# Altium project STM32F302VC_EVM.PrjPcb
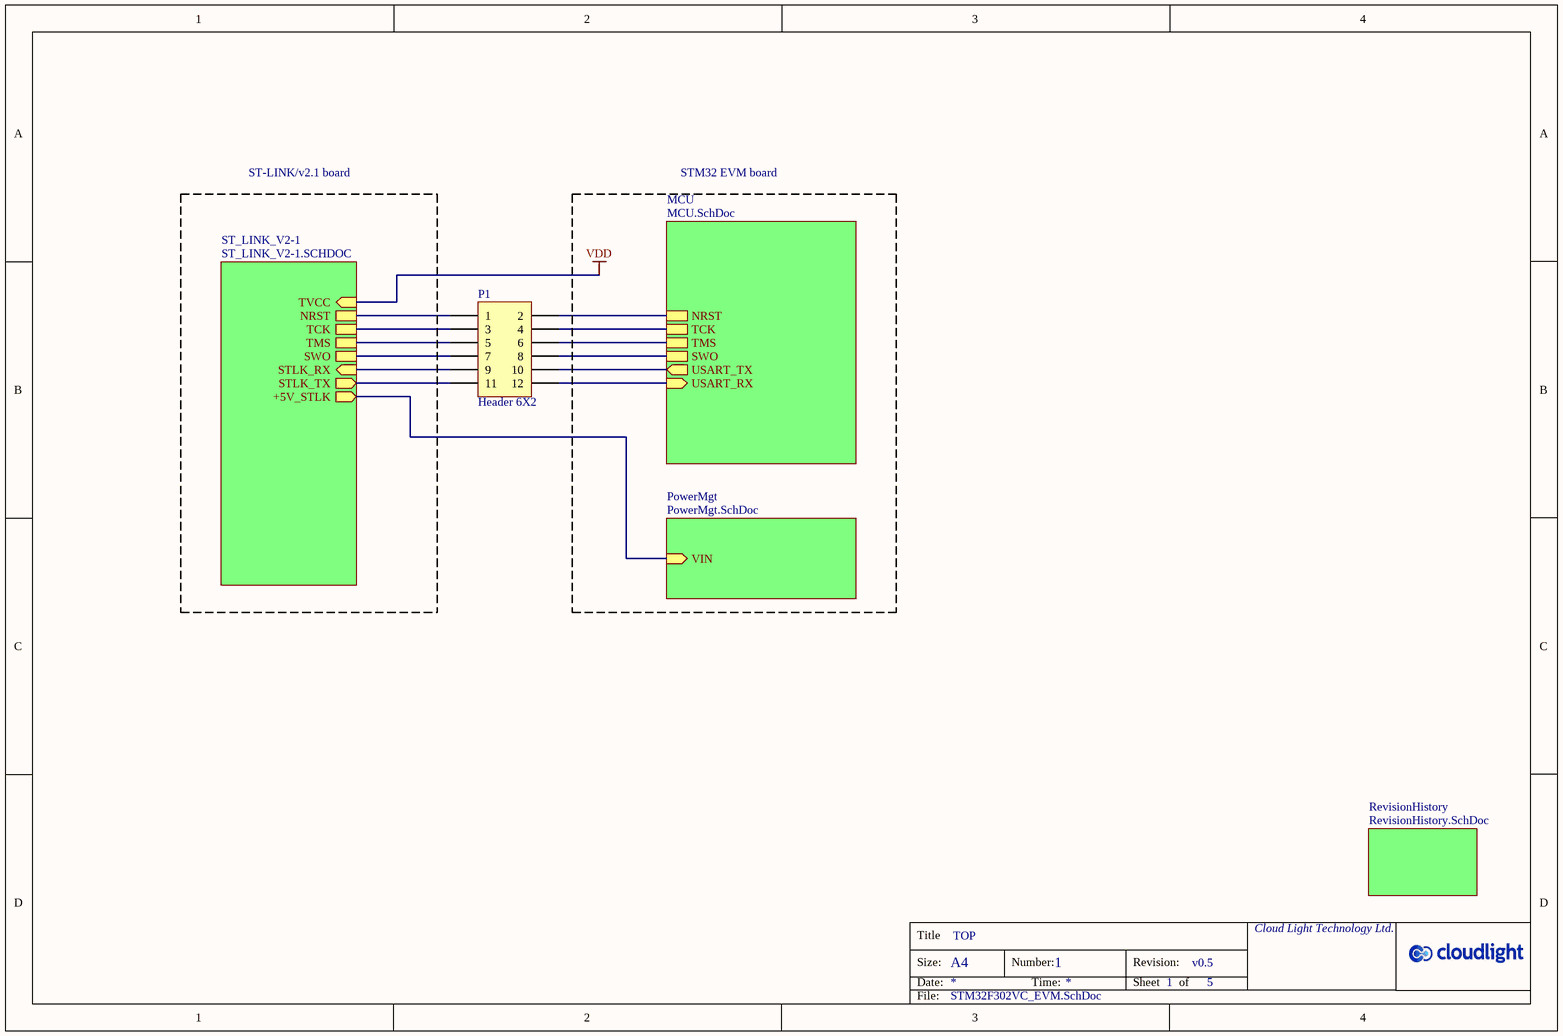
[diagram p0: STM32F302VC_EVM.SchDoc]
5 sheets, 117 parts. Net scope: hierarchical (ports join the sheet entries above them; power ports are global).
Board file: STM32F302VC_EVM.PcbDoc
Sheets:
  STM32F302VC_EVM.SchDoc
    PowerMgt = PowerMgt.SchDoc
    MCU = MCU.SchDoc
    ST_LINK_V2-1 = ST_LINK_V2-1.SchDoc
    RevisionHistory = RevisionHistory.SchDoc

## Sheet STM32F302VC_EVM.SchDoc
size A4; Organization: Altium Limited; Address1: L3, 12a Rodborough Rd; Address2: Frenchs Forest; Address3: NSW; Address4: Australia 2086; DocumentNumber: 1; SheetNumber: 1; SheetTotal: 5

### Parts
P1  Header 6X2  [HDR2X6]

### Sub-sheets
MCU = MCU.SchDoc: NRST, USART_RX (in), USART_TX (out), TCK, TMS, SWO
PowerMgt = PowerMgt.SchDoc: VIN
RevisionHistory = RevisionHistory.SchDoc: no entries
ST_LINK_V2-1 = ST_LINK_V2-1.SCHDOC: TMS, TCK, NRST, STLK_RX (in), STLK_TX (out), SWO, +5V_STLK, TVCC

### Nets
NRST: P1.2 ; sheet MCU/NRST
PA2: P1.10 ; sheet MCU/USART_TX
PA3: P1.12 ; sheet MCU/USART_RX
PA13: P1.6 ; sheet MCU/TMS
PA14: P1.4 ; sheet MCU/TCK
PB3: P1.8 ; sheet MCU/SWO
STLK_RX: P1.9 ; sheet ST_LINK_V2-1/STLK_RX
STLK_TX: P1.11 ; sheet ST_LINK_V2-1/STLK_TX
NetC1_1: sheet PowerMgt/VIN, sheet ST_LINK_V2-1/+5V_STLK
NetP1_1: P1.1 ; sheet ST_LINK_V2-1/NRST
NetP1_3: P1.3 ; sheet ST_LINK_V2-1/TCK
NetP1_5: P1.5 ; sheet ST_LINK_V2-1/TMS
NetP1_7: P1.7 ; sheet ST_LINK_V2-1/SWO

### Notes on the sheet
- ST-LINK/v2.1 board
- STM32 EVM board
- Title
- Size:
- Date:
- A4
- TOP
- Number:
- Time:
- Revision:
- Sheet
- 1
- of
- v0.5
- 5
- Cloud Light Technology Ltd.
- File:
- STM32F302VC_EVM.SchDoc

### Library data of the parts
P1 = Header 6X2: Header, 6-Pin, Dual row; Manufacturer: [N/A]; LatestRevisionDate: 17-Jul-2002; LatestRevisionNote: Re-released for DXP Platform.; Publisher: Altium Limited; PartNumber: [N/A]; Package: HDR2X6/T2.54/B2B; PackageDescription: Connector; Header; 2X6 Position; Pitch 2.54mm; Style Board to Board;; Supplier 1: [N/A]; Supplier Part Number 1: [N/A]

## Sheet PowerMgt.SchDoc
size A4; Organization: Altium Limited; Address1: L3, 12a Rodborough Rd; Address2: Frenchs Forest; Address3: NSW; Address4: Australia 2086; DocumentNumber: 2; SheetNumber: 2; SheetTotal: 5
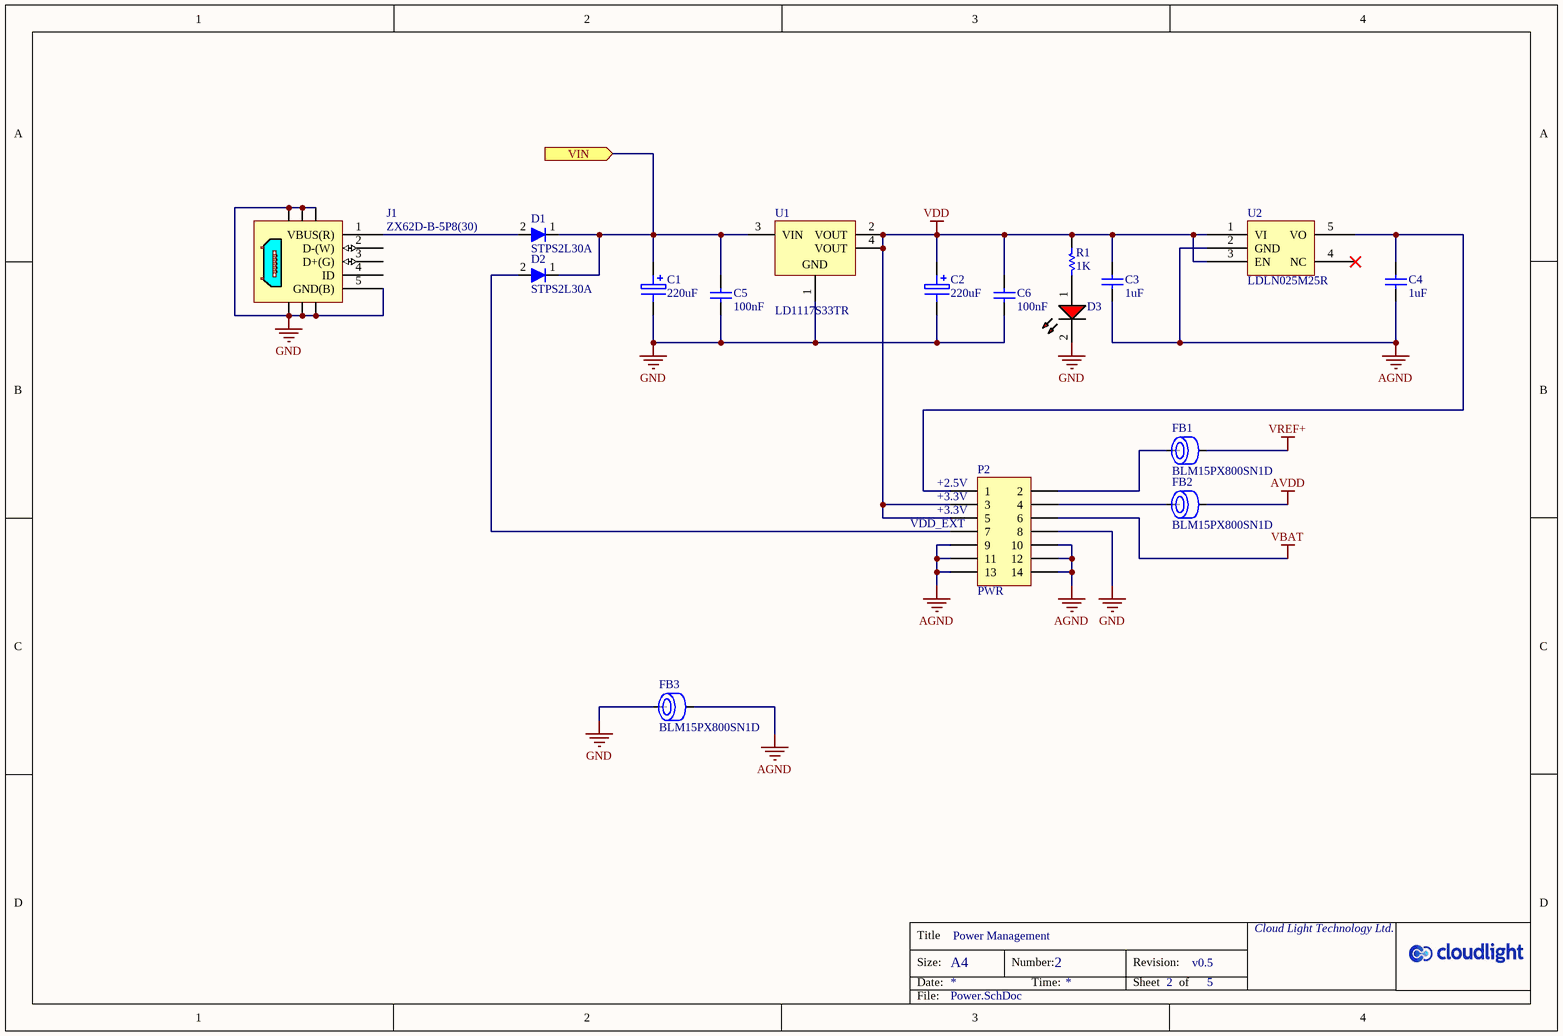
[diagram p1: PowerMgt.SchDoc]

### Parts
C1  220uF  [SMD-EC-F6.3]
C2  220uF  [SMD-EC-F6.3]
C3  1uF  [CAPC1608N]
C4  1uF  [CAPC1608N]
C5  100nF  [CAPC1608N]
C6  100nF  [CAPC1608N]
D1  STPS2L30A  [DIOM4326X25N]
D2  STPS2L30A  [DIOM4326X25N]
D3  LED-SMD0603-R  [CD1608-0603]  (value not drawn)
FB1  BLM15PX800SN1D  [FBC1005N]
FB2  BLM15PX800SN1D  [FBC1005N]
FB3  BLM15PX800SN1D  [FBC1005N]
J1  ZX62D-B-5P8(30)  [USB2.0-4H5]
P2  PWR  [HDR2X7]
R1  1K  [RESC1608N]
U1  LD1117S33TR  [SOT-223_N]
U2  LDLN025M25R  [SOT95P280X145-5N]

### Ports
VIN

### Nets
AGND: C3.1 C4.1 FB3.2 P2.9 P2.10 P2.11 P2.12 P2.13 P2.14 U2.2(GND)
AVDD: FB2.2
GND: C1.2 C2.2 C5.1 C6.1 D3.2(RK) FB3.1 J1.5(GND(B)) J1.6 J1.7 J1.8 J1.9 J1.10 J1.11 P2.8 U1.1(GND)
VBAT: P2.6
VDD: C2.1 C3.2 C6.2 P2.3 P2.5 R1.1 U1.2(VOUT) U1.4(VOUT) U2.1(VI) U2.3(EN)  [project net TVCC]
VREF+: FB1.2
NetC1_1: C1.1 C5.2 D1.1(K) D2.1(K) U1.3(VIN) ; port VIN
NetC4_2: C4.2 P2.1 U2.5(VO)
NetD1_2: D1.2(A) J1.1(VBUS(R))
NetD2_2: D2.2(A) P2.7
NetD3_1: D3.1(RA) R1.2
NetFB1_1: FB1.1 P2.2
NetFB2_1: FB2.1 P2.4

Not connected (* = marked no-connect by the designer): J1 2(D-(W)) 3(D+(G)) 4(ID); U2 4(NC)*

### Notes on the sheet
- (near P2) +2.5V
- (near P2) +3.3V
- (near P2) VDD_EXT
- Title
- Size:
- Date:
- A4
- Power Management
- Number:
- Time:
- Revision:
- Sheet
- 2
- of
- v0.5
- 5
- Cloud Light Technology Ltd.
- File:
- Power.SchDoc

### Library data of the parts
C1 C2 = EEE-FPC221XAP: 220μF 16V Aluminum Electrolytic Capacitors Radial, Can - SMD 160 mohm @ 100kHz 2000 Hrs @ 105°C; Manufacturer: Panasonic Electronic Components; Package: SMD-EC-F6.3; PackageDescription: SMD Aluminum Electrolytic Capacitors, Dia 6.3mm, Height 7.7mm; PartNumber: EEE-FPC221XAP; Supplier 1: Digi-Key; Supplier Part Number 1: PCE4537CT-ND; Value: 220uF
C3 C4 = Chip Capacitor: Manufacturer: [N/A]; Value: 1uF/16V/X7R/±20%; Revision: V1.0.0; Package: 0603; PackageDescription: 0603 Chip Capacitor; PartNumber: [N/A]; Supplier 1: [N/A]; Supplier Part Number 1: [N/A]; Publisher: Wentao SUN; Published: 16-Apr-2019
C5 C6 = Chip Capacitor: Manufacturer: [N/A]; Value: 100nF/16V/X7R/±10%; Revision: V1.0.0; Package: 0603; PackageDescription: 0603 Chip Capacitor; PartNumber: [N/A]; Supplier 1: [N/A]; Supplier Part Number 1: [N/A]; Publisher: Wentao SUN; Published: 16-Apr-2019
D1 D2 = STPS2L30A: Diode Schottky 30V 2A Surface Mount SMA; Manufacturer: STMicroelectronics; PartNumber: STPS2L30A; Package: DO-214AC, SMA; Supplier 1: Digi-Key; Supplier Part Number 1: 497-3759-1-ND; PackageDescription: Molded Diode, 2-Leads, Body 4.27x2.57mm; ComponentLink1Description: Digi-Key; ComponentLink1URL: https://www.digikey.com/products/en?keywords=497-3759-2-ND; Publisher: Wentao SUN; Published: 18-Apr-2019
D3 = LED-SMD0603-R: Single Color LED Indication, 0603, Red; Manufacturer: [N/A]; ComponentLink1Description: [N/A]; ComponentLink1URL: [N/A]; Package: 0603; PackageDescription: Chip Diode; Body 1.6 x 0.8 mm (LxW typ); PartNumber: [N/A]; Published: 21-Apr-2019; Publisher: Wentao SUN; Supplier 1: [N/A]; Supplier Part Number 1: [N/A]
FB1-FB3 = Ferrite Bead: 80 Ohms @ 100MHz 1 Power Line Ferrite Bead 0402 (1005 Metric) 2.3A 38mOhm; Manufacturer: Murata Electronics North America; Published: 16-Apr-2019; Revision: V1.0.0; Publisher: Wentao SUN; Package: 0402; PackageDescription: Chip Ferrite Bead Body 1.1x0.5mm; PartNumber: BLM15PX800SN1D; Supplier 1: Digi-Key; Supplier Part Number 1: 490-10663-1-ND
J1 = ZX62D-B-5P8(30): USB - micro B USB 2.0 Receptacle Connector 5-Pin; Manufacturer: Hirose Electric Co Ltd; PartNumber: ZX62D-B-5P8(30); Package: USB2.0-4H5; PackageDescription: USB Micro B, 0.65mm Pitch, 4 holes; Supplier 1: Digi-Key; Supplier Part Number 1: H125272CT-ND; ComponentLink1URL: https://www.digikey.com/products/en?keywords=H125272TR-ND; ComponentLink1Description: Digi-Key
P2 = Header 7X2: Header, 7-Pin, Dual row; Manufacturer: [N/A]; LatestRevisionDate: 17-Jul-2002; LatestRevisionNote: Re-released for DXP Platform.; Publisher: Altium Limited; PartNumber: [N/A]; Package: HDR2X7/T2.54/B2B; PackageDescription: Connector; Header; 2X7 Position; Pitch 2.54mm; Style Board to Board;; Supplier 1: [N/A]; Supplier Part Number 1: [N/A]
R1 = Chip Resistor: Manufacturer: [N/A]; Value: 1K/±5%/0.1W; Published: 16-Apr-2019; Revision: V1.0.0; Publisher: Wentao SUN; Package: 0603; PackageDescription: 0603 Chip Resistor; PartNumber: [N/A]; Supplier 1: [N/A]; Supplier Part Number 1: [N/A]
U1 = LD1117S33TR: Fixed Low Drop Positive Voltage Regulator, 3.3V, 4-Pin SOT-223, Tape and Reel; Manufacturer: STMicroelectronics; DatasheetVersion: Nov-2011; PackageVersion: 2010; PackageReference: SOT-223; PackageDescription: 4-Pin SOT-223 Package, 6.5 x 3.5 mm Body, 2.3 mm Pitch, 7 mm Lead Span; PartNumber: LD1117S33TR; ComponentLink1Description: Manufacturer URL; ComponentLink1URL: http://www.st.com; ComponentLink2Description: Datasheet; ComponentLink2URL: http://www.st.com/internet/com/TECHNICAL_RESOURCES/TECHNICAL_LITERATURE/DATASHEET/CD00000544.pdf; Package: SOT-223; Supplier 1: Digi-Key; Supplier Part Number 1: 497-1242-1-ND
U2 = LDLN025M25R: Linear Voltage Regulator IC  1 Output  250mA SOT-23-5; Manufacturer: STMicroelectronics; PartNumber: LDLN025M25R; PackageDescription: Small Outine Transistor 5 Leads; Supplier 1: Digi-Key; Supplier Part Number 1: 497-17805-1-ND; Package: SOT-23-5L

## Sheet MCU.SchDoc
size A4; Organization: Altium Limited; Address1: L3, 12a Rodborough Rd; Address2: Frenchs Forest; Address3: NSW; Address4: Australia 2086; DocumentNumber: 4; SheetNumber: 4; SheetTotal: 5
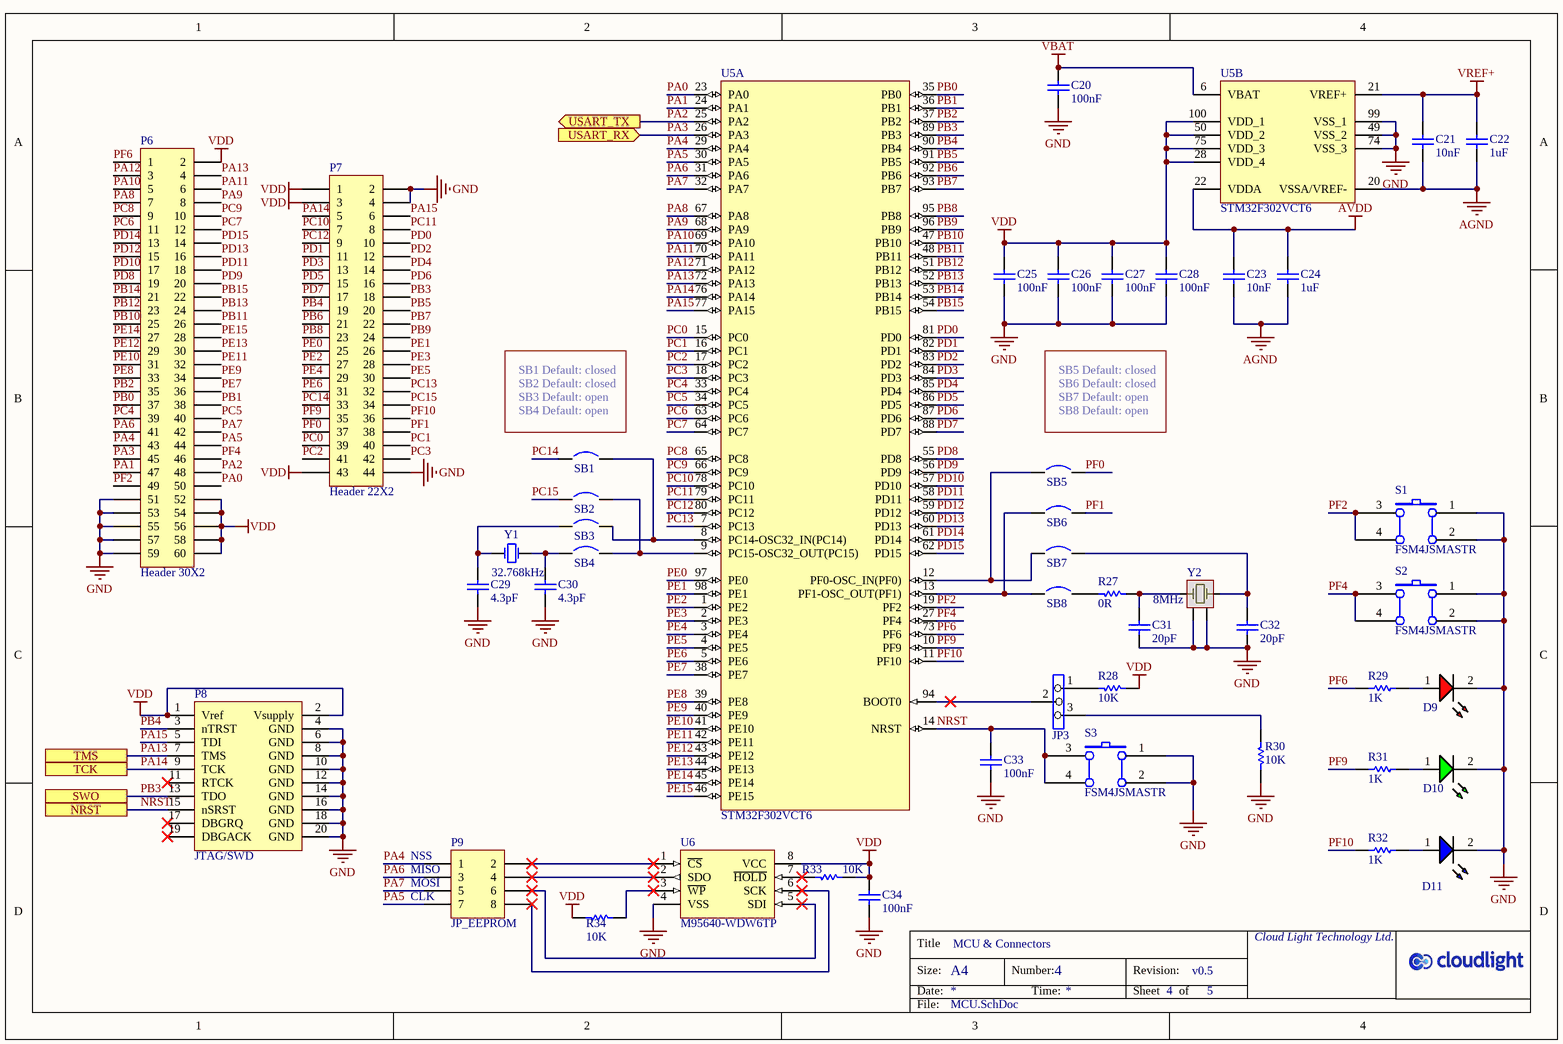
[diagram p2: MCU.SchDoc]

### Parts
C20  100nF  [CAPC1608N]
C21  10nF  [CAPC1608N]
C22  1uF  [CAPC1608N]
C23  10nF  [CAPC1608N]
C24  1uF  [CAPC1608N]
C25  100nF  [CAPC1608N]
C26  100nF  [CAPC1608N]
C27  100nF  [CAPC1608N]
C28  100nF  [CAPC1608N]
C29  4.3pF  [CAPC1608N]
C30  4.3pF  [CAPC1608N]
C31  20pF  [CAPC1608N]
C32  20pF  [CAPC1608N]
C33  100nF  [CAPC1608N]
C34  100nF  [CAPC1608N]
D9  LED-SMD0603-R  [CD1608-0603]  (value not drawn)
D10  LED-SMD0603-G  [CD1608-0603]  (value not drawn)
D11  LED-SMD0603-B  [CD1608-0603]  (value not drawn)
JP3  JP3  [SIP3/2.54]  (value not drawn)
P6  Header 30X2  [HDR2X30]
P7  Header 22X2  [HDR2X22]
P8  JTAG/SWD  [HDR2X10/T2.54/B2C]
P9  JP_EEPROM  [HDR2X4]
R27  0R  [RESC1608N]
R28  10K  [RESC1608N]
R29  1K  [RESC1608N]
R30  10K  [RESC1608N]
R31  1K  [RESC1608N]
R32  1K  [RESC1608N]
R33  10K  [RESC1608N]
R34  10K  [RESC1608N]
S1  FSM4JSMASTR  [SW_4PIN_S_6.0X6.0MM]
S2  FSM4JSMASTR  [SW_4PIN_S_6.0X6.0MM]
S3  FSM4JSMASTR  [SW_4PIN_S_6.0X6.0MM]
SB1  Circuit Breaker  [JP2_SMD]  (value not drawn)  (no BOM)
SB2  Circuit Breaker  [JP2_SMD]  (value not drawn)  (no BOM)
SB3  Circuit Breaker  [JP2_SMD]  (value not drawn)  (no BOM)
SB4  Circuit Breaker  [JP2_SMD]  (value not drawn)  (no BOM)
SB5  Circuit Breaker  [JP2_SMD]  (value not drawn)  (no BOM)
SB6  Circuit Breaker  [JP2_SMD]  (value not drawn)  (no BOM)
SB7  Circuit Breaker  [JP2_SMD]  (value not drawn)  (no BOM)
SB8  Circuit Breaker  [JP2_SMD]  (value not drawn)  (no BOM)
U5  STM32F302VCT6  [STM-LQFP100_N]  (parts A,B of 2)
U6  M95640-WDW6TP  [TSOP65P640X120-8N]
Y1  32.768kHz  [FC-12M]
Y2  8MHz  [12SMX-B-N]

### Ports
NRST, SWO, TCK, TMS, USART_RX (in), USART_TX (out)

### Nets
AGND: C21.1 C22.1 C23.1 C24.1 U5.20(VSSA/VREF-)
AVDD: C23.2 C24.2 U5.22(VDDA)
GND: C20.1 C25.1 C26.1 C27.1 C28.1 C29.1 C30.1 C31.1 C32.1 C33.1 C34.1 D9.2(RK) D10.2(RK) D11.2(RK) P6.51 P6.53 P6.55 P6.57 P6.59 P7.2 P7.4 P7.44 P8.4(GND) P8.6(GND) P8.8(GND) P8.10(GND) P8.12(GND) P8.14(GND) P8.16(GND) P8.18(GND) P8.20(GND) R30.2 S1.1 S1.2 S2.1 S2.2 S3.1 S3.2 U5.49(VSS_2) U5.74(VSS_3) U5.99(VSS_1) U6.4(VSS) Y2.2(GND) Y2.4(GND)
VBAT: C20.2 U5.6(VBAT)
VDD: C25.2 C26.2 C27.2 C28.2 C34.2 P6.2 P6.52 P6.54 P6.56 P6.58 P6.60 P7.1 P7.3 P7.43 P8.1(Vref) P8.2(Vsupply) R28.2 R33.2 R34.1 U5.28(VDD_4) U5.50(VDD_2) U5.75(VDD_3) U5.100(VDD_1) U6.8(VCC)  [project net TVCC]
VREF+: C21.2 C22.2 U5.21(VREF+)
NRST: C33.2 P8.15(nSRST) S3.3 S3.4 U5.14(NRST) ; port NRST
PA0: P6.50 U5.23(PA0)
PA1: P6.47 U5.24(PA1)
PA2: P6.48 U5.25(PA2) ; port USART_TX
PA3: P6.45 U5.26(PA3) ; port USART_RX
PA4: P6.43 P9.1 U5.29(PA4)
PA5: P6.44 P9.7 U5.30(PA5)
PA6: P6.41 P9.3 U5.31(PA6)
PA7: P6.42 P9.5 U5.32(PA7)
PA8: P6.7 U5.67(PA8)
PA9: P6.8 U5.68(PA9)
PA10: P6.5 U5.69(PA10)
PA11: P6.6 U5.70(PA11)
PA12: P6.3 U5.71(PA12)
PA13: P6.4 P8.7(TMS) U5.72(PA13) ; port TMS
PA14: P7.5 P8.9(TCK) U5.76(PA14) ; port TCK
PA15: P7.6 P8.5(TDI) U5.77(PA15)
PB0: P6.37 U5.35(PB0)
PB1: P6.38 U5.36(PB1)
PB2: P6.35 U5.37(PB2)
PB3: P7.18 P8.13(TDO) U5.89(PB3) ; port SWO
PB4: P7.19 P8.3(nTRST) U5.90(PB4)
PB5: P7.20 U5.91(PB5)
PB6: P7.21 U5.92(PB6)
PB7: P7.22 U5.93(PB7)
PB8: P7.23 U5.95(PB8)
PB9: P7.24 U5.96(PB9)
PB10: P6.25 U5.47(PB10)
PB11: P6.26 U5.48(PB11)
PB12: P6.23 U5.51(PB12)
PB13: P6.24 U5.52(PB13)
PB14: P6.21 U5.53(PB14)
PB15: P6.22 U5.54(PB15)
PC0: P7.39 U5.15(PC0)
PC1: P7.40 U5.16(PC1)
PC2: P7.41 U5.17(PC2)
PC3: P7.42 U5.18(PC3)
PC4: P6.39 U5.33(PC4)
PC5: P6.40 U5.34(PC5)
PC6: P6.11 U5.63(PC6)
PC7: P6.12 U5.64(PC7)
PC8: P6.9 U5.65(PC8)
PC9: P6.10 U5.66(PC9)
PC10: P7.7 U5.78(PC10)
PC11: P7.8 U5.79(PC11)
PC12: P7.9 U5.80(PC12)
PC13: P7.32 U5.7(PC13)
PC14: P7.33 SB1.1
PC15: P7.34 SB2.1
PD0: P7.10 U5.81(PD0)
PD1: P7.11 U5.82(PD1)
PD2: P7.12 U5.83(PD2)
PD3: P7.13 U5.84(PD3)
PD4: P7.14 U5.85(PD4)
PD5: P7.15 U5.86(PD5)
PD6: P7.16 U5.87(PD6)
PD7: P7.17 U5.88(PD7)
PD8: P6.19 U5.55(PD8)
PD9: P6.20 U5.56(PD9)
PD10: P6.17 U5.57(PD10)
PD11: P6.18 U5.58(PD11)
PD12: P6.15 U5.59(PD12)
PD13: P6.16 U5.60(PD13)
PD14: P6.13 U5.61(PD14)
PD15: P6.14 U5.62(PD15)
PE0: P7.25 U5.97(PE0)
PE1: P7.26 U5.98(PE1)
PE2: P7.27 U5.1(PE2)
PE3: P7.28 U5.2(PE3)
PE4: P7.29 U5.3(PE4)
PE5: P7.30 U5.4(PE5)
PE6: P7.31 U5.5(PE6)
PE7: P6.36 U5.38(PE7)
PE8: P6.33 U5.39(PE8)
PE9: P6.34 U5.40(PE9)
PE10: P6.31 U5.41(PE10)
PE11: P6.32 U5.42(PE11)
PE12: P6.29 U5.43(PE12)
PE13: P6.30 U5.44(PE13)
PE14: P6.27 U5.45(PE14)
PE15: P6.28 U5.46(PE15)
PF0: P7.37 SB5.2
PF1: P7.38 SB6.2
PF2: P6.49 S1.3 S1.4 U5.19(PF2)
PF4: P6.46 S2.3 S2.4 U5.27(PF4)
PF6: P6.1 R29.1 U5.73(PF6)
PF9: P7.35 R31.1 U5.10(PF9)
PF10: P7.36 R32.1 U5.11(PF10)
NetC29_2: C29.2 SB3.1 Y1.2(OSC2)
NetC30_2: C30.2 SB4.1 Y1.1(OSC1)
NetC31_2: C31.2 R27.1 Y2.1(OSC1)
NetC32_2: C32.2 SB7.2 Y2.3(OSC2)
NetD9_1: D9.1(RA) R29.2
NetD10_1: D10.1(RA) R31.2
NetD11_1: D11.1(RA) R32.2
NetJP3_1: JP3.1 R28.1
NetJP3_2: JP3.2 U5.94(BOOT0)
NetJP3_3: JP3.3 R30.1
NetP9_2: P9.2 U6.1(~{CS})
NetP9_4: P9.4 U6.2(SDO)
NetP9_6: P9.6 U6.5(SDI)
NetP9_8: P9.8 U6.6(SCK)
NetR27_2: R27.2 SB8.2
NetR33_1: R33.1 U6.7(~{HOLD})
NetR34_2: R34.2 U6.3(~{WP})
NetSB1_2: SB1.2 SB3.2 U5.8(PC14-OSC32_IN(PC14))
NetSB2_2: SB2.2 SB4.2 U5.9(PC15-OSC32_OUT(PC15))
NetSB5_1: SB5.1 SB7.1 U5.12(PF0-OSC_IN(PF0))
NetSB6_1: SB6.1 SB8.1 U5.13(PF1-OSC_OUT(PF1))

Not connected (* = marked no-connect by the designer): P8 11(RTCK)* 17(DBGRQ)* 19(DBGACK)*

### Notes on the sheet
- SB1 Default: closed
- SB2 Default: closed
- SB5 Default: closed
- SB6 Default: closed
- SB3 Default: open
- (near SB1) SB4 Default: open
- SB7 Default: open
- SB8 Default: open
- (near P9) NSS
- (near P9) MISO
- (near P9) MOSI
- (near P9) CLK
- Title
- Size:
- Date:
- A4
- MCU & Connectors
- Number:
- Time:
- Revision:
- Sheet
- 4
- of
- v0.5
- 5
- Cloud Light Technology Ltd.
- File:
- MCU.SchDoc

### Library data of the parts
C20 C25-C28 C33 C34 = Chip Capacitor: as C5 on sheet PowerMgt; Revision: V1.0.0; Package: 0603; PackageDescription: 0603 Chip Capacitor; PartNumber: [N/A]; Supplier 1: [N/A]; Supplier Part Number 1: [N/A]; Publisher: Wentao SUN; Published: 16-Apr-2019
C21 C23 = Chip Capacitor: Manufacturer: [N/A]; Value: 10nF/25V/X7R/±20%; Revision: V1.0.0; Package: 0603; PackageDescription: 0603 Chip Capacitor; PartNumber: [N/A]; Supplier 1: [N/A]; Supplier Part Number 1: [N/A]; Publisher: Wentao SUN; Published: 16-Apr-2019
C22 C24 = Chip Capacitor: as C3 on sheet PowerMgt; Revision: V1.0.0; Package: 0603; PackageDescription: 0603 Chip Capacitor; PartNumber: [N/A]; Supplier 1: [N/A]; Supplier Part Number 1: [N/A]; Publisher: Wentao SUN; Published: 16-Apr-2019
C29 C30 = Chip Capacitor: Manufacturer: [N/A]; Value: 4.3pF/100V/C0G/±0.25pF; Revision: V1.0.0; Package: 0603; PackageDescription: 0603 Chip Capacitor; PartNumber: [N/A]; Supplier 1: [N/A]; Supplier Part Number 1: [N/A]; Publisher: Wentao SUN; Published: 16-Apr-2019
C31 C32 = Chip Capacitor: Manufacturer: [N/A]; Value: 20pF/100V/C0G/±5%; Revision: V1.0.0; Package: 0603; PackageDescription: 0603 Chip Capacitor; PartNumber: [N/A]; Supplier 1: [N/A]; Supplier Part Number 1: [N/A]; Publisher: Wentao SUN; Published: 16-Apr-2019
D9 = LED-SMD0603-R: as D3 on sheet PowerMgt; ComponentLink1Description: [N/A]; ComponentLink1URL: [N/A]; Package: 0603; PackageDescription: Chip Diode; Body 1.6 x 0.8 mm (LxW typ); PartNumber: [N/A]; Published: 21-Apr-2019; Publisher: Wentao SUN; Supplier 1: [N/A]; Supplier Part Number 1: [N/A]
D10 = LED-SMD0603-G: Single Color LED Indication, 0603, Green; Manufacturer: [N/A]; ComponentLink1Description: [N/A]; ComponentLink1URL: [N/A]; Package: 0603; PackageDescription: Chip Diode; Body 1.6 x 0.8 mm (LxW typ); PartNumber: [N/A]; Published: 21-Apr-2019; Publisher: Wentao SUN; Supplier 1: [N/A]; Supplier Part Number 1: [N/A]
D11 = LED-SMD0603-B: Single Color LED Indication, 0603, Blue; Manufacturer: [N/A]; ComponentLink1Description: [N/A]; ComponentLink1URL: [N/A]; Package: 0603; PackageDescription: Chip Diode; Body 1.6 x 0.8 mm (LxW typ); PartNumber: [N/A]; Published: 21-Apr-2019; Publisher: Wentao SUN; Supplier 1: [N/A]; Supplier Part Number 1: [N/A]
JP3 = JP3: Jumper 3; Manufacturer: [N/A]; PartNumber: [N/A]; Package: HDR3/T2.54/B2B; PackageDescription: Connector; Header; 3 Position; Pitch 2.54mm; Style Board to Board;; Supplier 1: [N/A]; Supplier Part Number 1: [N/A]
P6 = Header 30X2: Header, 30-Pin, Dual row; Manufacturer: [N/A]; LatestRevisionDate: 17-Jul-2002; LatestRevisionNote: Re-released for DXP Platform.; Publisher: Altium Limited; PartNumber: [N/A]; Supplier Part Number 1: [N/A]; Supplier 1: [N/A]; Package: HDR2X30/T2.54/B2B; PackageDescription: Connector; Header; 2X30 Position; Pitch 2.54mm; Style Board to Board;
P7 = Header 22X2: Header, 22-Pin, Dual row; Manufacturer: [N/A]; LatestRevisionDate: 17-Jul-2002; LatestRevisionNote: Re-released for DXP Platform.; Publisher: Altium Limited; PartNumber: [N/A]; Supplier Part Number 1: [N/A]; Supplier 1: [N/A]; Package: HDR2X22/T2.54/B2B; PackageDescription: Connector; Header; 2X22 Position; Pitch 2.54mm; Style Board to Board;
P8 = JTAG: Header, JTAG; Manufacturer: On Shore Technology Inc.; PartNumber: 302-S201; LatestRevisionDate: 17-Apr-2019; LatestRevisionNote: Re-released for DXP Platform.; Publisher: Wentao SUN; Package: HDR2X10/T2.54/B2C; PackageDescription: Connector; Header; 10x2 Position; Pitch 2.54mm; Style Board to Cable;; Supplier 1: Digi-Key; Supplier Part Number 1: ED10524-ND; ComponentLink1Description: Digi-Key; ComponentLink1URL: https://www.digikey.com/products/en?keywords=ED10524-ND
P9 = Header 4X2: Header, 4-Pin, Dual row; Manufacturer: [N/A]; LatestRevisionDate: 17-Jul-2002; LatestRevisionNote: Re-released for DXP Platform.; Publisher: Altium Limited; Package: HDR2X4/T2.54/B2B; PackageDescription: Connector; Header; 2X4 Position; Pitch 2.54mm; Style Board to Board;; Supplier 1: [N/A]; Supplier Part Number 1: [N/A]; PartNumber: [N/A]; ComponentLink1Description: [N/A]; ComponentLink1URL: [N/A]
R27 = Chip Resistor: Manufacturer: [N/A]; Value: 0R/Jumper/0.1W; Published: 16-Apr-2019; Revision: V1.0.0; Publisher: Wentao SUN; Package: 0603; PackageDescription: 0603 Chip Resistor; PartNumber: [N/A]; Supplier 1: [N/A]; Supplier Part Number 1: [N/A]
R28 R30 R33 R34 = Chip Resistor: Manufacturer: [N/A]; Value: 10K/±5%/0.1W; Published: 16-Apr-2019; Revision: V1.0.0; Publisher: Wentao SUN; Package: 0603; PackageDescription: 0603 Chip Resistor; PartNumber: [N/A]; Supplier 1: [N/A]; Supplier Part Number 1: [N/A]
R29 R31 R32 = Chip Resistor: Manufacturer: [N/A]; Value: 1K/±5%/0.1W; Published: 16-Apr-2019; Revision: V1.0.0; Publisher: Wentao SUN; Package: 0603; PackageDescription: 0603 Chip Resistor; PartNumber: [N/A]; Supplier 1: [N/A]; Supplier Part Number 1: [N/A]
S1-S3 = FSM4JSMASTR: Tactile Switch SPST-NO Top Actuated Surface Mount; Manufacturer: TE Connectivity; Package: SW_4PIN_S_6.0X6.0MM; PackageDescription: Surface Mount Switch, 4 Leads, Body 6.0*6.0mm, Pitch 4.5mm/8.4mm; PartNumber: FSM4JSMASTR; Supplier 1: Digi-Key; Supplier Part Number 1: 450-2141-1-ND
SB1-SB8 = Circuit Breaker: Solder: NO; Published: 24-Mar-1999; Revision: July-2002: Re-released for DXP Platform.; Publisher: Altium Limited
U5 = STM32F302VCT6: ARM Cortex-M4 32-bit MCU, 256 KB Flash, 32 KB Internal RAM, 87 I/Os, 100-pin LQFP, -40 to 85 degC, Tray; Manufacturer: STMicroelectronics; D/A Converter: 1x12-bit (1 Channel); FLASH Size (Prog) (kB): 256; I/Os (High Current): 87; Internal RAM Size (kB): 32; Operating Frequency(F) (Processor speed) (MHz): 72; Supply Voltage(Vcc) min (V): 2; DatasheetVersion: Rev. 6; PackageVersion: Rev. 1, 06/2013; PackageReference: LQFP100; PackageDescription: 100-Pin Low Profile Quad Flat Package, 14 x 14 mm Body, 0.5 mm Pitch; Supplier 1: Digi-Key; Supplier Part Number 1: 497-17420-ND; Supplier 2: Farnell; Supplier Part Number 2: 2333253; Supplier 3: Newark; Supplier Part Number 3: 99W9870; Supplier 4: Newark; Supplier Part Number 4: 48W6878; Supplier 5: Mouser; Supplier Part Number 5: 511-STM32F302VCT6; Core: ARM Cortex-M4; Packing: Tray; Mounting Technology: Surface Mount; PartNumber: STM32F302VCT6; ComponentLink1Description: Manufacturer URL; ComponentLink1URL: http://www.st.com/web/en/home.html; ComponentLink2Description: Datasheet; ComponentLink2URL: http://www.st.com/st-web-ui/static/active/en/resource/technical/document/datasheet/DM00058181.pdf; ComponentLink3Description: Package Specification; ComponentLink3URL: http://www.st.com/st-web-ui/static/active/en/resource/technical/document/data_brief/DM00071938.pdf; Package: LQFP100
U6 = M95640-WDW6TP: EEPROM Memory IC 64Kb (8K x 8) SPI 20MHz 8-TSSOP; Manufacturer: STMicroelectronics; Package: 8-TSSOP; PackageDescription: TSOP, 8-Leads, Body 3.00x4.40mm, Pitch 0.65mm; PartNumber: M95640-WDW6TP; Supplier 1: Digi-Key; Supplier Part Number 1: 497-8699-1-ND
Y1 = FC-12M 32.7680KA-A5: 32.768kHz ±20ppm Crystal 12.5pF 90 kOhms 2-SMD, No Lead; Manufacturer: EPSON; Package: FC-12M; PackageDescription: 2-SMD, No Lead, Outline 2.05*1.20mm; PartNumber: FC-12M 32.7680KA-A5; Supplier 1: Digi-Key; Supplier Part Number 1: SER4080CT-ND; Value: 32.768kHz
Y2 = LFXTAL056516REEL: 8MHz ±30ppm Crystal 12pF 80 Ohms 4-SMD, No Lead; Manufacturer: IQD Frequency Product Ltd.; Package: 12SMX-B; PackageDescription: 4-SMD, No Lead; PartNumber: LFXTAL056516REEL; Supplier 1: Digi-Key; Supplier Part Number 1: 1923-1017-1-ND; Value: 8MHz

## Sheet ST_LINK_V2-1.SchDoc
size A4; Organization: Altium Limited; Address1: L3, 12a Rodborough Rd; Address2: Frenchs Forest; Address3: NSW; Address4: Australia 2086; DocumentNumber: 3; SheetNumber: 3; SheetTotal: 5
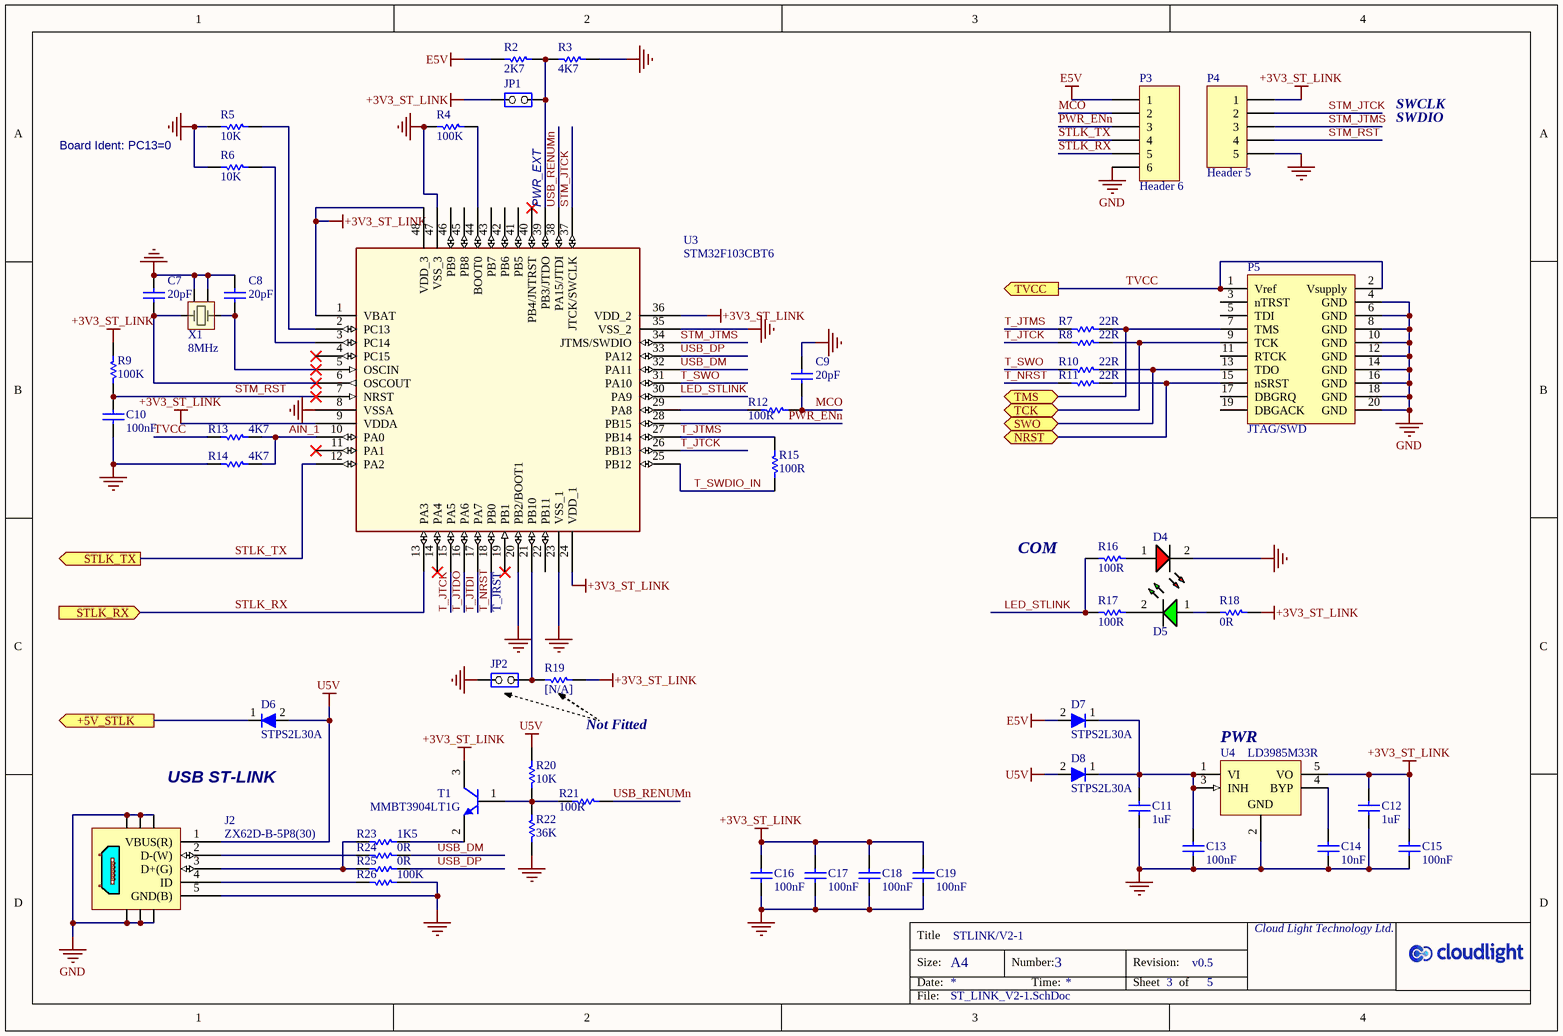
[diagram p3: ST_LINK_V2-1.SchDoc]

### Parts
C7  20pF  [CAPC1608N]
C8  20pF  [CAPC1608N]
C9  20pF  [CAPC1608N]
C10  100nF  [CAPC1608N]
C11  1uF  [CAPC1608N]
C12  1uF  [CAPC1608N]
C13  100nF  [CAPC1608N]
C14  10nF  [CAPC1608N]
C15  100nF  [CAPC1608N]
C16  100nF  [CAPC1608N]
C17  100nF  [CAPC1608N]
C18  100nF  [CAPC1608N]
C19  100nF  [CAPC1608N]
D4  LED-SMD0603-R  [CD1608-0603]  (value not drawn)
D5  LED-SMD0603-G  [CD1608-0603]  (value not drawn)
D6  STPS2L30A  [DIOM4326X25N]
D7  STPS2L30A  [DIOM4326X25N]
D8  STPS2L30A  [DIOM4326X25N]
J2  ZX62D-B-5P8(30)  [USB2.0-4H5]
JP1  JP2  [SIP2/2.54]  (value not drawn)
JP2  JP2  [SIP2/2.54]  (value not drawn)
P3  Header 6  [HDR1X6]
P4  Header 5  [HDR1X5]
P5  JTAG/SWD  [HDR2X10/T2.54/B2C]
R2  2K7  [RESC1608N]
R3  4K7  [RESC1608N]
R4  100K  [RESC1608N]
R5  10K  [RESC1608N]
R6  10K  [RESC1608N]
R7  22R  [RESC1608N]
R8  22R  [RESC1608N]
R9  100K  [RESC1608N]
R10  22R  [RESC1608N]
R11  22R  [RESC1608N]
R12  100R  [RESC1608N]
R13  4K7  [RESC1608N]
R14  4K7  [RESC1608N]
R15  100R  [RESC1608N]
R16  100R  [RESC1608N]
R17  100R  [RESC1608N]
R18  0R  [RESC1608N]
R19  [N/A]  [RESC1608N]
R20  10K  [RESC1608N]
R21  100R  [RESC1608N]
R22  36K  [RESC1608N]
R23  1K5  [RESC1608N]
R24  0R  [RESC1608N]
R25  0R  [RESC1608N]
R26  100K  [RESC1608N]
T1  MMBT3904LT1G  [ONSC-SOT-23-3-318-08_V]
U3  STM32F103CBT6  [QFP48 7X7]
U4  LD3985M33R  [SOT23-5L_N]
X1  8MHz  [12SMX-B-N]

### Ports
+5V_STLK, NRST, STLK_RX (in), STLK_TX (out), SWO, TCK, TMS, TVCC

### Nets
+3V3_ST_LINK: C12.2 C15.2 C16.2 C17.2 C18.2 C19.2 JP1.1(COMMON) P4.1 R9.2 R18.1 R19.1 T1.3(C) U3.1(VBAT) U3.9(VDDA) U3.24(VDD_1) U3.36(VDD_2) U3.48(VDD_3) U4.5(VO)
E5V: D7.2(A) P3.1 R2.1
GND: C7.2 C8.2 C9.2 C10.1 C11.1 C12.1 C13.1 C14.1 C15.1 C16.1 C17.1 C18.1 C19.1 D4.2(RK) J2.5(GND(B)) J2.6 J2.7 J2.8 J2.9 J2.10 J2.11 JP2.1(COMMON) P3.6 P4.5 P5.4(GND) P5.6(GND) P5.8(GND) P5.10(GND) P5.12(GND) P5.14(GND) P5.16(GND) P5.18(GND) P5.20(GND) R3.2 R4.1 R5.1 R6.1 R14.1 R22.1 R26.2 U3.8(VSSA) U3.20(PB2/BOOT1) U3.23(VSS_1) U3.35(VSS_2) U3.47(VSS_3) U4.2(GND) X1.2(GND) X1.4(GND)
TVCC: P5.1(Vref) P5.2(Vsupply) R13.1 ; port TVCC
U5V: D6.2(A) D8.2(A) J2.1(VBUS(R)) R20.2
AIN_1: R13.2 R14.2 U3.10(PA0)
LED_STLINK: R16.2 R17.2 U3.30(PA9)
MCO: C9.1 P3.2 R12.2
PWR_ENn: P3.3 U3.28(PB15)
STLK_RX: P3.5 U3.13(PA3) ; port STLK_RX
STLK_TX: P3.4 U3.12(PA2) ; port STLK_TX
STM_JTCK: P4.2 U3.37(JTCK/SWCLK)
STM_JTMS: P4.3 U3.34(JTMS/SWDIO)
STM_RST: C10.2 P4.4 R9.1 U3.7(NRST)
T_JTCK: R8.1 U3.15(PA5) U3.26(PB13)
T_JTDI: U3.17(PA7)
T_JTDO: U3.16(PA6)
T_JTMS: R7.1 R15.2 U3.27(PB14)
T_NRST: R11.1 U3.18(PB0)
T_SWDIO_IN: R15.1 U3.25(PB12)
T_SWO: R10.1 U3.31(PA10)
USB_DM: R24.2 U3.32(PA11)
USB_DP: R25.2 U3.33(PA12)
USB_RENUMn: R21.2 U3.38(PA15/JTDI)
NetC1_1: D6.1(K) ; port +5V_STLK
NetC7_1: C7.1 U3.6(OSCOUT) X1.3(OSC2)
NetC8_1: C8.1 U3.5(OSCIN) X1.1(OSC1)
NetC11_2: C11.2 C13.2 D7.1(K) D8.1(K) U4.1(VI) U4.3(INH)
NetC14_2: C14.2 U4.4(BYP)
NetD4_1: D4.1(RA) R16.1
NetD5_1: D5.1(RA) R18.2
NetD5_2: D5.2(RK) R17.1
NetJ2_2: J2.2(D-(W)) R24.1
NetJ2_3: J2.3(D+(G)) R23.1 R25.1
NetJ2_4: J2.4(ID) R26.1
NetJP1_2: JP1.2(NO) R2.2 R3.1 U3.39(PB3/JTDO)
NetJP2_2: JP2.2(NO) R19.2 U3.21(PB10)
NetP1_1: P5.15(nSRST) R11.2 ; port NRST
NetP1_3: P5.9(TCK) R8.2 ; port TCK
NetP1_5: P5.7(TMS) R7.2 ; port TMS
NetP1_7: P5.13(TDO) R10.2 ; port SWO
NetR4_2: R4.2 U3.44(BOOT0)
NetR5_2: R5.2 U3.2(PC13)
NetR6_2: R6.2 U3.3(PC14)
NetR12_1: R12.1 U3.29(PA8)
NetR20_1: R20.1 R21.1 R22.2 T1.1(B)
NetR23_2: R23.2 T1.2(E)

Not connected (* = marked no-connect by the designer): P5 3(nTRST) 5(TDI) 11(RTCK) 17(DBGRQ) 19(DBGACK); U3 4(PC15)* 11(PA1)* 14(PA4)* 19(PB1)* 22(PB11) 40(PB4/JNTRST)* 41(PB5) 42(PB6) 43(PB7) 45(PB8) 46(PB9)

### Notes on the sheet
- SWCLK
- Board Ident: PC13=0
- SWDIO
- (near U3) PWR_EXT
- COM
- T_JRST
- USB ST-LINK
- Not Fitted
- (near U4) PWR
- Title
- Size:
- Date:
- A4
- STLINK/V2-1
- Number:
- Time:
- Revision:
- Sheet
- 3
- of
- v0.5
- 5
- Cloud Light Technology Ltd.
- File:
- ST_LINK_V2-1.SchDoc

### Library data of the parts
C7-C9 = Chip Capacitor: as C31 on sheet MCU; Revision: V1.0.0; Package: 0603; PackageDescription: 0603 Chip Capacitor; PartNumber: [N/A]; Supplier 1: [N/A]; Supplier Part Number 1: [N/A]; Publisher: Wentao SUN; Published: 16-Apr-2019
C10 C13 C15-C19 = Chip Capacitor: as C5 on sheet PowerMgt; Revision: V1.0.0; Package: 0603; PackageDescription: 0603 Chip Capacitor; PartNumber: [N/A]; Supplier 1: [N/A]; Supplier Part Number 1: [N/A]; Publisher: Wentao SUN; Published: 16-Apr-2019
C11 C12 = Chip Capacitor: as C3 on sheet PowerMgt; Revision: V1.0.0; Package: 0603; PackageDescription: 0603 Chip Capacitor; PartNumber: [N/A]; Supplier 1: [N/A]; Supplier Part Number 1: [N/A]; Publisher: Wentao SUN; Published: 16-Apr-2019
C14 = Chip Capacitor: as C21 on sheet MCU; Revision: V1.0.0; Package: 0603; PackageDescription: 0603 Chip Capacitor; PartNumber: [N/A]; Supplier 1: [N/A]; Supplier Part Number 1: [N/A]; Publisher: Wentao SUN; Published: 16-Apr-2019
D4 = LED-SMD0603-R: as D3 on sheet PowerMgt; ComponentLink1Description: [N/A]; ComponentLink1URL: [N/A]; Package: 0603; PackageDescription: Chip Diode; Body 1.6 x 0.8 mm (LxW typ); PartNumber: [N/A]; Published: 21-Apr-2019; Publisher: Wentao SUN; Supplier 1: [N/A]; Supplier Part Number 1: [N/A]
D5 = LED-SMD0603-G: as D10 on sheet MCU; ComponentLink1Description: [N/A]; ComponentLink1URL: [N/A]; Package: 0603; PackageDescription: Chip Diode; Body 1.6 x 0.8 mm (LxW typ); PartNumber: [N/A]; Published: 21-Apr-2019; Publisher: Wentao SUN; Supplier 1: [N/A]; Supplier Part Number 1: [N/A]
D6-D8 = STPS2L30A: as D1 on sheet PowerMgt; PartNumber: STPS2L30A; Package: DO-214AC, SMA; Supplier 1: Digi-Key; Supplier Part Number 1: 497-3759-1-ND; PackageDescription: Molded Diode, 2-Leads, Body 4.27x2.57mm; ComponentLink1Description: Digi-Key; ComponentLink1URL: https://www.digikey.com/products/en?keywords=497-3759-2-ND; Publisher: Wentao SUN; Published: 18-Apr-2019
J2 = ZX62D-B-5P8(30): as J1 on sheet PowerMgt; PartNumber: ZX62D-B-5P8(30); Package: USB2.0-4H5; PackageDescription: USB Micro B, 0.65mm Pitch, 4 holes; Supplier 1: Digi-Key; Supplier Part Number 1: H125272CT-ND; ComponentLink1URL: https://www.digikey.com/products/en?keywords=H125272TR-ND; ComponentLink1Description: Digi-Key
JP1 JP2 = JP2: Jumper 2; Manufacturer: [N/A]; PartNumber: [N/A]; Package: HDR2/T2.54/B2B; PackageDescription: Connector; Header; 2 Position; Pitch 2.54mm; Style Board to Board;; Supplier 1: [N/A]; Supplier Part Number 1: [N/A]
P3 = Header 6: Header, 6-Pin; Manufacturer: [N/A]; LatestRevisionDate: 17-Jul-2002; LatestRevisionNote: Re-released for DXP Platform.; Publisher: Altium Limited; PartNumber: [N/A]; Package: HDR6/T2.54/B2B; PackageDescription: Connector; Header; 6 Position; Pitch 2.54mm; Style Board to Board;; Supplier 1: [N/A]; Supplier Part Number 1: [N/A]
P4 = Header 5: Header, 5-Pin; Manufacturer: [N/A]; LatestRevisionDate: 17-Jul-2002; LatestRevisionNote: Re-released for DXP Platform.; Publisher: Altium Limited; PartNumber: [N/A]; Package: HDR5/T2.54/B2B; PackageDescription: Connector; Header; 5 Position; Pitch 2.54mm; Style Board to Board;; Supplier 1: [N/A]; Supplier Part Number 1: [N/A]
P5 = JTAG: as P8 on sheet MCU; LatestRevisionDate: 17-Apr-2019; LatestRevisionNote: Re-released for DXP Platform.; Publisher: Wentao SUN; Package: HDR2X10/T2.54/B2C; PackageDescription: Connector; Header; 10x2 Position; Pitch 2.54mm; Style Board to Cable;; Supplier 1: Digi-Key; Supplier Part Number 1: ED10524-ND; ComponentLink1Description: Digi-Key; ComponentLink1URL: https://www.digikey.com/products/en?keywords=ED10524-ND
R2 = Chip Resistor: Manufacturer: [N/A]; Value: 2K7/±5%/0.1W; Published: 16-Apr-2019; Revision: V1.0.0; Publisher: Wentao SUN; Package: 0603; PackageDescription: 0603 Chip Resistor; PartNumber: [N/A]; Supplier 1: [N/A]; Supplier Part Number 1: [N/A]
R3 R13 R14 = Chip Resistor: Manufacturer: [N/A]; Value: 4K7/±5%/0.1W; Published: 16-Apr-2019; Revision: V1.0.0; Publisher: Wentao SUN; Package: 0603; PackageDescription: 0603 Chip Resistor; PartNumber: [N/A]; Supplier 1: [N/A]; Supplier Part Number 1: [N/A]
R4 R9 R26 = Chip Resistor: Manufacturer: [N/A]; Value: 100K/±5%/0.1W; Published: 16-Apr-2019; Revision: V1.0.0; Publisher: Wentao SUN; Package: 0603; PackageDescription: 0603 Chip Resistor; PartNumber: [N/A]; Supplier 1: [N/A]; Supplier Part Number 1: [N/A]
R5 R6 R20 = Chip Resistor: Manufacturer: [N/A]; Value: 10K/±5%/0.1W; Published: 16-Apr-2019; Revision: V1.0.0; Publisher: Wentao SUN; Package: 0603; PackageDescription: 0603 Chip Resistor; PartNumber: [N/A]; Supplier 1: [N/A]; Supplier Part Number 1: [N/A]
R7 R8 R10 R11 = Chip Resistor: Manufacturer: [N/A]; Value: 22R/±5%/0.1W; Published: 16-Apr-2019; Revision: V1.0.0; Publisher: Wentao SUN; Package: 0603; PackageDescription: 0603 Chip Resistor; PartNumber: [N/A]; Supplier 1: [N/A]; Supplier Part Number 1: [N/A]
R12 R15-R17 R21 = Chip Resistor: Manufacturer: [N/A]; Value: 100R/±5%/0.1W; Published: 16-Apr-2019; Revision: V1.0.0; Publisher: Wentao SUN; Package: 0603; PackageDescription: 0603 Chip Resistor; PartNumber: [N/A]; Supplier 1: [N/A]; Supplier Part Number 1: [N/A]
R18 R24 R25 = Chip Resistor: as R27 on sheet MCU; Published: 16-Apr-2019; Revision: V1.0.0; Publisher: Wentao SUN; Package: 0603; PackageDescription: 0603 Chip Resistor; PartNumber: [N/A]; Supplier 1: [N/A]; Supplier Part Number 1: [N/A]
R19 = Chip Resistor: Published: 16-Apr-2019; Revision: V1.0.0; Publisher: Wentao SUN; Manufacturer: [N/A]; Package: 0603; PackageDescription: 0603 Chip Resistor; PartNumber: [N/A]; Supplier 1: [N/A]; Supplier Part Number 1: [N/A]; Value: [N/A]
R22 = Chip Resistor: Manufacturer: [N/A]; Value: 36K/±5%/0.1W; Published: 16-Apr-2019; Revision: V1.0.0; Publisher: Wentao SUN; Package: 0603; PackageDescription: 0603 Chip Resistor; PartNumber: [N/A]; Supplier 1: [N/A]; Supplier Part Number 1: [N/A]
R23 = Chip Resistor: Manufacturer: [N/A]; Value: 1K5/±5%/0.1W; Published: 16-Apr-2019; Revision: V1.0.0; Publisher: Wentao SUN; Package: 0603; PackageDescription: 0603 Chip Resistor; PartNumber: [N/A]; Supplier 1: [N/A]; Supplier Part Number 1: [N/A]
T1 = MMBT3904LT1G: General Purpose Transistor, NPN Silicon, 3-Pin SOT-23, Pb-Free, Tape and Reel; Manufacturer: On Semiconductor; fT Min (MHz): 300; IC Continuous (A): 0.2; DatasheetVersion: Rev. 12; PackageVersion: Rev. AP, 11/2009; PackageReference: SOT-23-3-318-08; PackageDescription: 3-Pin Small Outline Transistor, Body 2.92 x 1.3 mm, Pitch 0.95 mm; Supplier 1: Digi-Key; Supplier Part Number 1: MMBT3904LT1GOSCT-ND; Supplier 2: Digi-Key; Supplier Part Number 2: MMBT3904LT1GOSTR-ND; Supplier 3: Digi-Key; Supplier Part Number 3: MMBT3904LT1GOSDKR-ND; Supplier 4: Farnell; Supplier Part Number 4: 2317804; Supplier 5: Farnell; Supplier Part Number 5: 1459100; Supplier 6: Farnell; Supplier Part Number 6: 1459100RL; Supplier 7: Newark; Supplier Part Number 7: 83K0942; Supplier 8: Newark; Supplier Part Number 8: 83H7337; Supplier 9: Newark; Supplier Part Number 9: 28X7922; Supplier 10: Mouser; Supplier Part Number 10: 863-MMBT3904LT1G; Packing: Tape and Reel; Polarity: NPN; RoHS: TRUE; Mounting Technology: Surface Mount; PartNumber: MMBT3904LT1G; ComponentLink1Description: Manufacturer URL; ComponentLink1URL: http://www.onsemi.com/; ComponentLink2Description: Datasheet; ComponentLink2URL: http://www.onsemi.cn/pub_link/Collateral/MMBT3904LT1-D.PDF; ComponentLink3Description: Package Specification; ComponentLink3URL: http://www.onsemi.cn/pub_link/Collateral/318-08.PDF; Package: SOT-23-3-318-08
U3 = STM32F103CBT6: Medium-density performance line ARM-based 32-bit MCU with 64KB Flash; PartNumber: STM32F103C8T6TR; Manufacturer: STMicroelectronics; Package: LQFP48; PackageDescription: TSQFP, 48-Leads, Body 7.0x7.0mm (max), Pitch 0.50mm; Supplier 1: Digi-Key; Supplier Part Number 1: 497-17666-1-ND; Published: 23-Apr-2019; Publisher: Wentao SUN
U4 = LD3985M33R: 150mA, Ultra-Low Drop Low Noise BiCMOS Voltage Regulators Low ESR Capacitors Compatible, 3.3V, 5-Pin SOT23-5L; Manufacturer: STMicroelectronics; DatasheetVersion: Jan-2011; PackageVersion: 2008; PackageReference: SOT23-5L; PackageDescription: 5-Pin SOT-23 Package, 2.9 x 1.6 mm Body, 0.95 mm Pitch, 2.8 mm Lead Span; PartNumber: LD3985M33R; ComponentLink1Description: Digi-Key; ComponentLink1URL: https://www.digikey.com/products/en?keywords=497-3504-2-ND; ComponentLink2Description: Datasheet; ComponentLink2URL: http://www.st.com/internet/com/TECHNICAL_RESOURCES/TECHNICAL_LITERATURE/DATASHEET/CD00003395.pdf; Package: SOT23-5L; Supplier 1: Digi-Key; Supplier Part Number 1: 497-3504-1-ND
X1 = LFXTAL056516REEL: as Y2 on sheet MCU; Package: 12SMX-B; PackageDescription: 4-SMD, No Lead; PartNumber: LFXTAL056516REEL; Supplier 1: Digi-Key; Supplier Part Number 1: 1923-1017-1-ND; Value: 8MHz

## Sheet RevisionHistory.SchDoc
size A4; Organization: Altium Limited; Address1: L3, 12a Rodborough Rd; Address2: Frenchs Forest; Address3: NSW; Address4: Australia 2086; DocumentNumber: 5; SheetNumber: 5; SheetTotal: 5
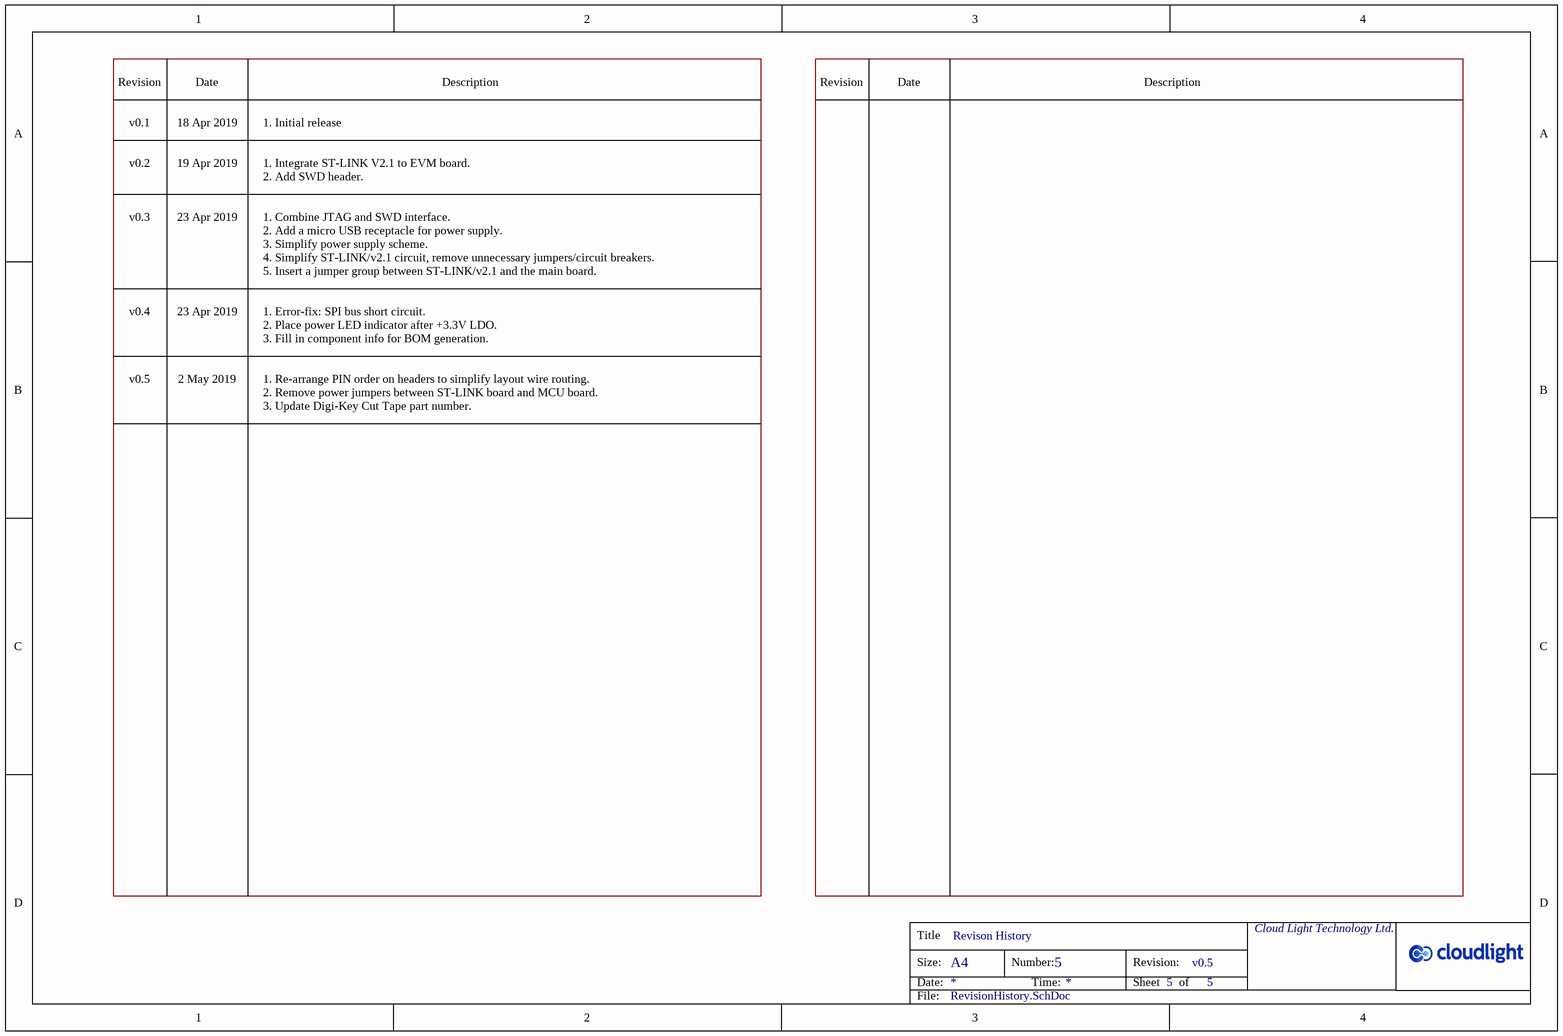
[diagram p4: RevisionHistory.SchDoc]

### Notes on the sheet
- Revision
- Date
- Description
- v0.1
- v0.2
- 18 Apr 2019
- 19 Apr 2019
- 1. Initial release
- 1. Integrate ST-LINK V2.1 to EVM board.
  2. Add SWD header.
- v0.3
- 23 Apr 2019
- v0.4
- 1. Combine JTAG and SWD interface.
  2. Add a micro USB receptacle for power supply.
  3. Simplify power supply scheme.
  4. Simplify ST-LINK/v2.1 circuit, remove unnecessary jumpers/circuit breakers.
  5. Insert a jumper group between ST-LINK/v2.1 and the main board.
- v0.5
- 2 May 2019
- 1. Error-fix: SPI bus short circuit.
  2. Place power LED indicator after +3.3V LDO.
  3. Fill in component info for BOM generation.
- 1. Re-arrange PIN order on headers to simplify layout wire routing.
  2. Remove power jumpers between ST-LINK board and MCU board.
  3. Update Digi-Key Cut Tape part number.
- Title
- Size:
- Date:
- A4
- Revison History
- Number:
- Time:
- Revision:
- Sheet
- 5
- of
- Cloud Light Technology Ltd.
- File:
- RevisionHistory.SchDoc

## Nets that join several sheets
AGND: PowerMgt (10 pins), MCU (5 pins)
AVDD: PowerMgt (FB2.2), MCU (C23.2 C24.2 U5.22)
GND: PowerMgt (15 pins), MCU (44 pins), ST_LINK_V2-1 (48 pins)
TVCC: PowerMgt (10 pins), MCU (24 pins), ST_LINK_V2-1 (P5.1 P5.2 R13.1)
VBAT: PowerMgt (P2.6), MCU (C20.2 U5.6)
VREF+: PowerMgt (FB1.2), MCU (C21.2 C22.2 U5.21)
NetC1_1: PowerMgt (5 pins), ST_LINK_V2-1 (D6.1)
NetP1_1: STM32F302VC_EVM (P1.1), ST_LINK_V2-1 (P5.15 R11.2)
NetP1_3: STM32F302VC_EVM (P1.3), ST_LINK_V2-1 (P5.9 R8.2)
NetP1_5: STM32F302VC_EVM (P1.5), ST_LINK_V2-1 (P5.7 R7.2)
NetP1_7: STM32F302VC_EVM (P1.7), ST_LINK_V2-1 (P5.13 R10.2)
NRST: STM32F302VC_EVM (P1.2), MCU (5 pins)
PA2: STM32F302VC_EVM (P1.10), MCU (P6.48 U5.25)
PA3: STM32F302VC_EVM (P1.12), MCU (P6.45 U5.26)
PA13: STM32F302VC_EVM (P1.6), MCU (P6.4 P8.7 U5.72)
PA14: STM32F302VC_EVM (P1.4), MCU (P7.5 P8.9 U5.76)
PB3: STM32F302VC_EVM (P1.8), MCU (P7.18 P8.13 U5.89)
STLK_RX: STM32F302VC_EVM (P1.9), ST_LINK_V2-1 (P3.5 U3.13)
STLK_TX: STM32F302VC_EVM (P1.11), ST_LINK_V2-1 (P3.4 U3.12)